# Altium schematic sheet Fri3D_2020_Power.SchDoc: Power
size A3; Date: 11/07/2018; DrawnBy: Wim Van Gool; DocumentNumber: 5; Revision: 00; SheetNumber: 5; SheetTotal: 5
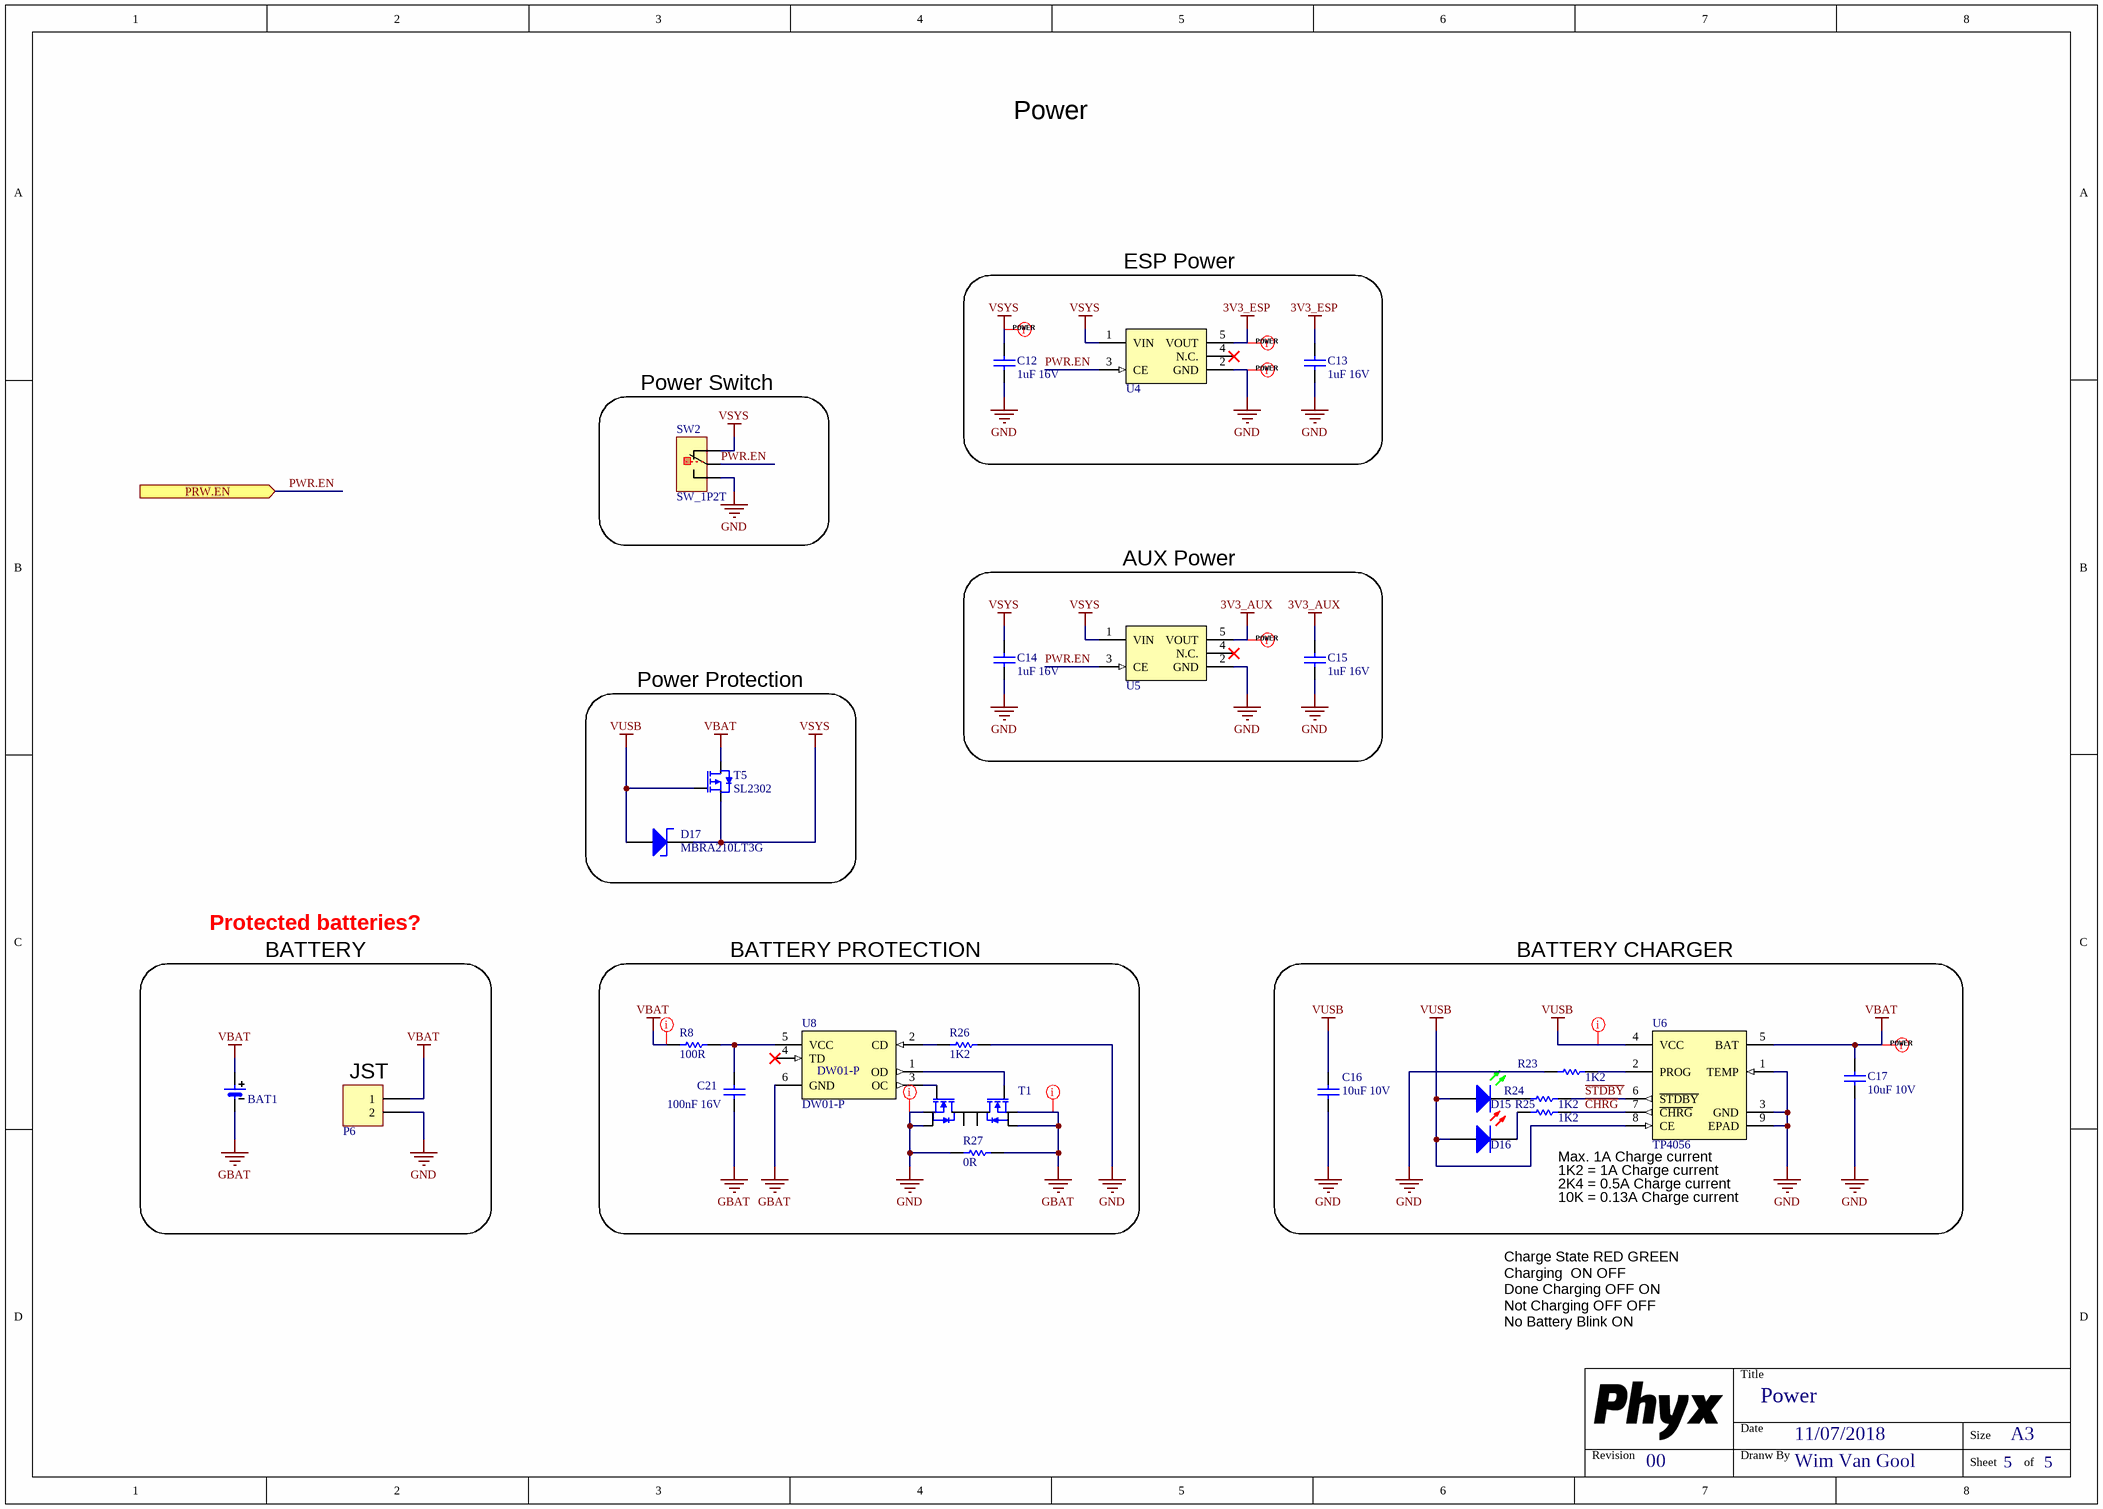
[diagram p0: Fri3D_2020_Power.SchDoc]

## Parts
BAT1  18650 Battery holder with spring  [BAT_18650_SPRING]  (value not drawn)
C12  value 1uF 16V  [C0603_N]  (hidden comment: CAP_CERAMIC)
C13  value 1uF 16V  [C0603_N]  (hidden comment: CAP_CERAMIC)
C14  value 1uF 16V  [C0603_N]  (hidden comment: CAP_CERAMIC)
C15  value 1uF 16V  [C0603_N]  (hidden comment: CAP_CERAMIC)
C16  value 10uF 10V  [C0805_N]  (hidden comment: CAP_CERAMIC)
C17  value 10uF 10V  [C0805_N]  (hidden comment: CAP_CERAMIC)
C21  value 100nF 16V  [C0603_N]
D15  Default 0805 Green LED  [LED_0805_GR]  (value not drawn)
D16  Default 0805 Red LED  [LED_0805_RD]  (value not drawn)
D17  MBRA210LT3G  [SMA_AC]
P6  Header 2.0mm Shrouded 2  [WE_620102131822]  (value not drawn)
R8  value 100R  [R0603_N]  (hidden comment: RESISTOR)
R23  value 1K2  [R0603_N]  (hidden comment: RESISTOR)
R24  value 1K2  [R0603_N]  (hidden comment: RESISTOR)
R25  value 1K2  [R0603_N]  (hidden comment: RESISTOR)
R26  value 1K2  [R0603_N]  (hidden comment: RESISTOR)
R27  value 0R  [R0603_N]
SW2  SW_1P2T  [WE_450404015514]
T1  Dual N-Ch MOSFET Common Drain  [TSSOP_8_65P]  (value not drawn)
T5  SL2302  [SOT23-3]
U4  3V3 LDO 700mA 50mV  [SOT23-5]  (value not drawn)
U5  3V3 LDO 700mA 50mV  [SOT23-5]  (value not drawn)
U6  value TP4056  [SOIC_N_8_TH]  (hidden comment: Single Cell LiIon charger max 1A)
U8  value DW01-P  [SOT23-6]  (hidden comment: DW01-P single cell lithium protection)

## Blocks framed on the sheet
ESP Power: C12 C13 U4
Power Switch: SW2
AUX Power: C14 C15 U5
Power Protection: D17 T5
BATTERY PROTECTION: C21 R8 R26 R27 T1 U8
BATTERY CHARGER: C16 C17 D15 D16 R23-R25 U6

## Ports
PRW.EN (in)

## Nets
3V3_AUX: C15.1 U5.5(VOUT)
3V3_ESP: C13.1 U4.5(VOUT)
GBAT: BAT1.2 C21.2 R27.1 T1.2(S1) T1.3(S1) U8.6(GND)
GND: C12.2 C13.2 C14.2 C15.2 C16.2 C17.2 P6.2 R23.2 R26.2 R27.2 SW2.3 T1.6(S2) T1.7(S2) U4.2(GND) U5.2(GND) U6.1(TEMP) U6.3(GND) U6.9(EPAD)
VBAT: BAT1.1 C17.1 P6.1 R8.1 T5.3(D) U6.5(BAT)
VSYS: C12.1 C14.1 D17.C SW2.1 T5.2(S) U4.1(VIN) U5.1(VIN)
VUSB: C16.1 D15.1(A) D16.1(A) D17.A T5.1(G) U6.4(VCC) U6.8(CE)
~{CHRG}: R25.2 U6.7(~{CHRG})
PWR.EN: SW2.2 U4.3(CE) U5.3(CE) ; port PRW.EN
~{STDBY}: R24.2 U6.6(~{STDBY})
NetC21_1: C21.1 R8.2 U8.5(VCC)
NetD15_2: D15.2(K) R24.1
NetD16_2: D16.2(K) R25.1
NetR23_1: R23.1 U6.2(PROG)
NetR26_1: R26.1 U8.2(CD)
NetT1_4: T1.4(G1) U8.1(OD)
NetT1_5: T1.5(G2) U8.3(OC)

Not connected (* = marked no-connect by the designer): T1 1(D1) 8(D2); U4 4(N.C.)*; U5 4(N.C.)*; U8 4(TD)*

## Layout directives
net class POWER: 3V3_AUX, 3V3_ESP, GBAT, GND, VBAT, VSYS, VUSB

## Notes on the sheet
- BATTERY
- Protected batteries?
- (near P6) JST
- 1K2 = 1A Charge current
- 2K4 = 0.5A Charge current
- Max. 1A Charge current
- 10K = 0.13A Charge current
- Charge State	RED	GREEN
  Charging		ON	OFF
  Done Charging	OFF	ON
  Not Charging	OFF	OFF
  No Battery	Blink	ON
- Title
- Revision
- Date
- Dranw By
- Size
- A3
- Sheet
- of

## Library data of the parts
BAT1 = 18650 Battery holder spring CN: =Description; Value: 18650_SPRING; Supplier 1: TaoBao; Supplier Part Number 1: 39761834568
C12-C15 = CAP # 1uF 16V 0603: Capacitor Ceramic; Supplier 1: Farnell; Supplier Part Number 1: 2320814
C16 C17 = CAP # 10uF 10V 0805: Capacitor Ceramic; Supplier 1: Farnell; Supplier Part Number 1: 2320859
C21 = CAP # 100nF 16V 0603: Capacitor Ceramic
D15 = LED # Green 0805: =Description; Supplier 1: Farnell; Supplier Part Number 1: 2099239
D16 = LED # Red 0805: =Description; Supplier 1: Farnell; Supplier Part Number 1: 2099236
D17 = Schottky # MBRA210LT3G: =Description
P6 = HDR # SHR 2.0mm 2way - 620102131822: Value: 620102131822; Supplier 1: Wurth
R8 = RES # 100R 0603
R23-R26 = RES # 1K2 0603
R27 = RES # 0R 0603: Supplier 1: Farnell; Supplier Part Number 1: 2447743
SW2 = SW # 1P2T WS-SLSU mini slide 6,7 x 2,7 mm
T1 = FS8205A Dual N-Ch common Drain for DW01-P: =Description; Value: FS8205A; Supplier 1: AliExpress; Supplier Part Number 1: FS8205A
T5 = SL2302 P-Ch MOSFET 4.1A 20Vds: =Description
U4 U5 = LDO # 3V3 XC6210B33: =Designator; Value: XC6210B332MR; Supplier 1: Farnell; Supplier Part Number 1: 1057803
U6 = CHG # TP4056 LiIon 1A: =Description; Supplier 1: Aliexpress; Supplier Part Number 1: TP4056
U8 = PWR # DW01-P Lithium protection: =Description; Supplier 1: Aliexpress; Supplier Part Number 1: DW01-P